# Altium schematic sheet 测试板2.SchDoc
size A3
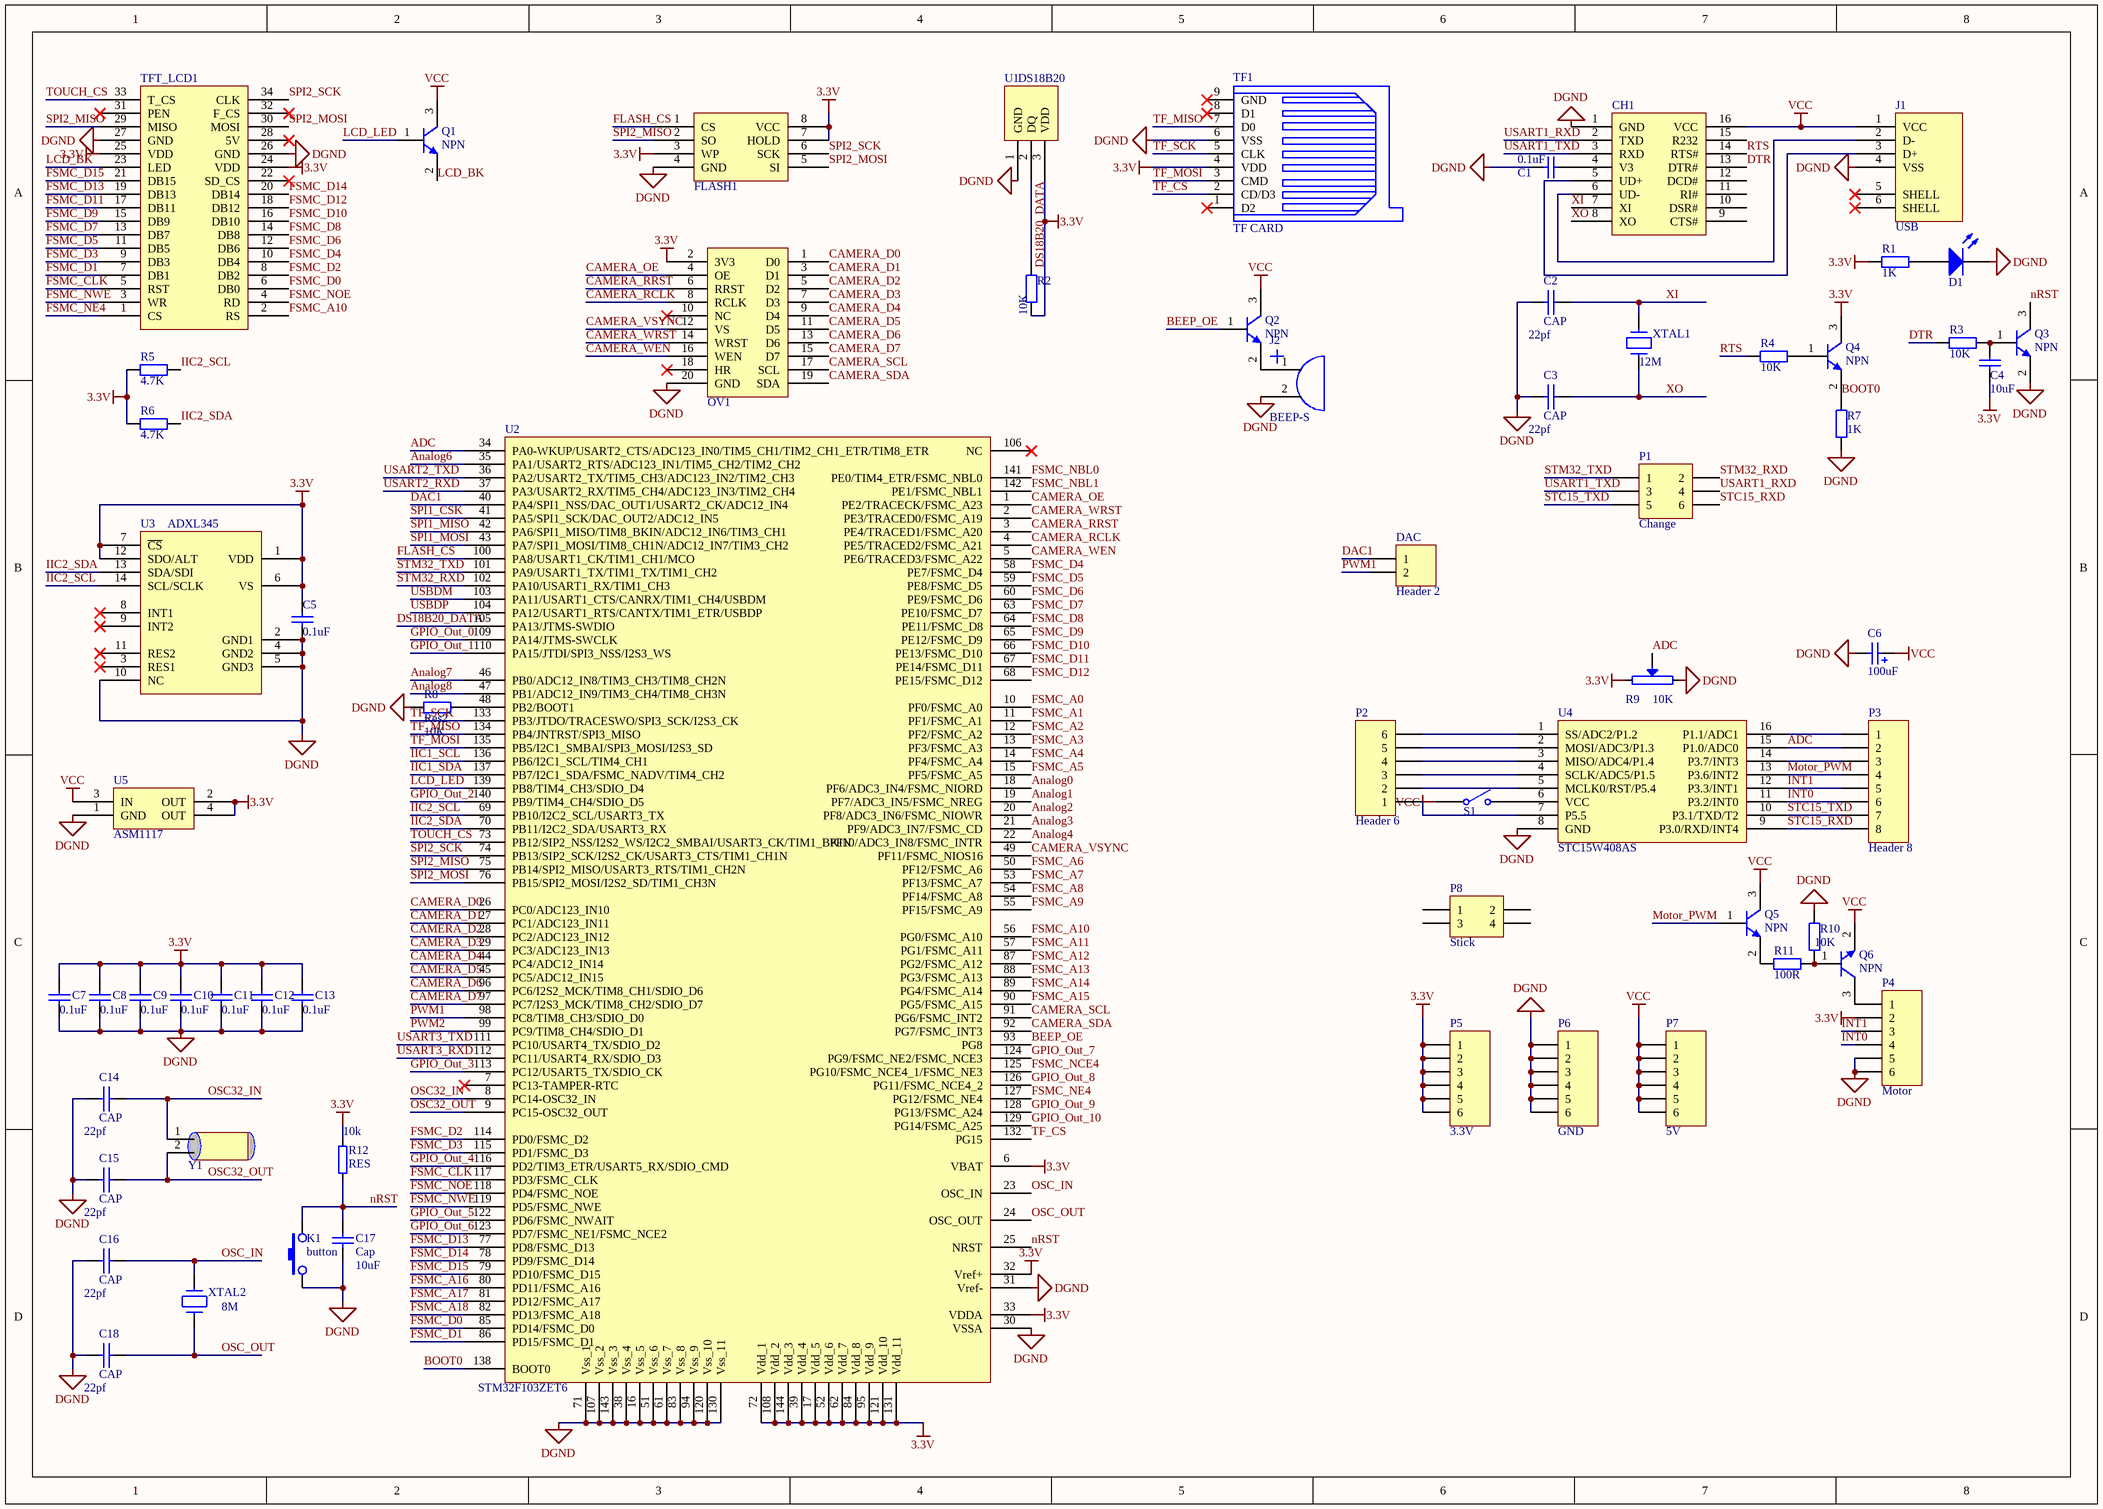
[diagram p0: 测试板2.SchDoc]

## Parts
C1  value 0.1uF  [0805]  (hidden comment: Cap)
C2  CAP  value 22pf  [0805]
C3  CAP  value 22pf  [0805]
C4  value 10uF  [1206]  (hidden comment: Cap)
C5  value 0.1uF  [0805]  (hidden comment: Cap)
C6  value 100uF  [RB.1/.3]  (hidden comment: Cap Pol2)
C7  value 0.1uF  [0805]  (hidden comment: Cap)
C8  value 0.1uF  [0805]  (hidden comment: Cap)
C9  value 0.1uF  [0805]  (hidden comment: Cap)
C10  value 0.1uF  [0805]  (hidden comment: Cap)
C11  value 0.1uF  [0805]  (hidden comment: Cap)
C12  value 0.1uF  [0805]  (hidden comment: Cap)
C13  value 0.1uF  [0805]  (hidden comment: Cap)
C14  CAP  value 22pf  [0805]
C15  CAP  value 22pf  [0805]
C16  CAP  value 22pf  [0805]
C17  Cap  value 10uF  [1206]
C18  CAP  value 22pf  [0805]
CH1  Component_1  [SOIC127P600X170-16N]  (value not drawn)
D1  LED0  [LED-0805]  (value not drawn)
DAC  Header 2  [HDR1X2]
FLASH1  W25Q64  [8S2_L]  (value not drawn)
J1  USB  [USB_B1]
J2  BEEP-S  [BEEP-S]
K1  button  [SW_PB4_A1]
OV1  OV7725摄像头  [HDR2X10]  (value not drawn)
P1  Change  [HDR2X3]
P2  Header 6  [HDR1X6]
P3  Header 8  [HDR1X8]
P4  Motor  [HDR1X6]
P5  3.3V  [HDR1X6]
P6  GND  [HDR1X6]
P7  5V  [HDR1X6]
P8  Stick  [HDR2X2]
Q1  NPN  [SOT23-3]
Q2  NPN  [SOT23-3]
Q3  NPN  [SOT23-3]
Q4  NPN  [SOT23-3]
Q5  NPN  [SOT23-3]
Q6  NPN  [SOT89N]
R1  value 1K  [0805]  (hidden comment: Res2)
R2  value 10K  [0805]  (hidden comment: Res2)
R3  value 10K  [0805]  (hidden comment: Res2)
R4  value 10K  [0805]  (hidden comment: Res2)
R5  value 4.7K  [0805]  (hidden comment: Res2)
R6  value 4.7K  [0805]  (hidden comment: Res2)
R7  value 1K  [0805]  (hidden comment: Res2)
R8  Res2  value 10K  [0805]
R9  10K  [RVR-2]
R10  value 10K  [0805]  (hidden comment: Res2)
R11  value 100R  [0805]  (hidden comment: Res2)
R12  RES  value 10k  [0805]
S1  SW-SPST  [SWITCH_B1]  (value not drawn)
TF1  TF CARD  [TFP09-2-12B]
TFT_LCD1  Component_1  [HDR2X17]  (value not drawn)
U1  DS18B20  [TO-92A]
U2  STM32F103ZET6  [TQFP-144]
U3  ADXL345  [PCBComponent_1]
U4  STC15W408AS  [SOIC127P600X170-16N]
U5  ASM1117  [SOT223]
XTAL1  value 12M  [X-SM49]  (hidden comment: CRYSTAL)
XTAL2  value 8M  [X-SM49]  (hidden comment: CRYSTAL)
Y1  32K晶振  [X-TC15]  (value not drawn)

## Nets
3.3V: C4.1 C5.2 C7.2 C8.2 C9.2 C10.2 C11.2 C12.2 C13.2 FLASH1.3(WP) FLASH1.7(HOLD) FLASH1.8(VCC) OV1.2(3V3) P4.2 P5.1 P5.2 P5.3 P5.4 P5.5 P5.6 Q4.3(C) R1.1 R2.1 R5.1 R6.1 R9.1 R12.2 TF1.4(VDD) TFT_LCD1.24(VDD) TFT_LCD1.25(VDD) U1.3(VDD) U2.6(VBAT) U2.17(Vdd_5) U2.32(Vref+) U2.33(VDDA) U2.39(Vdd_4) U2.52(Vdd_6) U2.62(Vdd_7) U2.72(Vdd_1) U2.84(Vdd_8) U2.95(Vdd_9) U2.108(Vdd_2) U2.121(Vdd_10) U2.131(Vdd_11) U2.144(Vdd_3) U3.1(VDD) U3.6(VS) U3.7(~{CS}) U3.12(SDO/ALT) U5.2(OUT) U5.4(OUT)
DGND: C1.2 C2.1 C3.1 C5.1 C6.2 C7.1 C8.1 C9.1 C10.1 C11.1 C12.1 C13.1 C14.1 C15.1 C16.1 C17.1 C18.1 CH1.1(GND) D1.2(K) FLASH1.4(GND) J1.4(VSS) J2.2 K1.1 OV1.20(GND) P4.5 P4.6 P6.1 P6.2 P6.3 P6.4 P6.5 P6.6 Q3.2(E) R7.1 R8.1 R9.2 R10.1 TF1.6(VSS) TFT_LCD1.26(GND) TFT_LCD1.27(GND) U1.1(GND) U2.16(Vss_5) U2.30(VSSA) U2.31(Vref-) U2.38(Vss_4) U2.51(Vss_6) U2.61(Vss_7) U2.71(Vss_1) U2.83(Vss_8) U2.94(Vss_9) U2.107(Vss_2) U2.120(Vss_10) U2.130(Vss_11) U2.143(Vss_3) U3.2(GND1) U3.4(GND2) U3.5(GND3) U3.10(NC) U4.8(GND) U5.1(GND)
VCC: C6.1 CH1.16(VCC) J1.1(VCC) P7.1 P7.2 P7.3 P7.4 P7.5 P7.6 Q1.3(C) Q2.3(C) Q5.3(C) Q6.2(E) S1.1(COMMON) U5.3(IN)
ADC: P3.2 R9.W U2.34(PA0-WKUP/USART2_CTS/ADC123_IN0/TIM5_CH1/TIM2_CH1_ETR/TIM8_ETR) U4.15(P1.0/ADC0)
Analog0: U2.18(PF6/ADC3_IN4/FSMC_NIORD)
Analog1: U2.19(PF7/ADC3_IN5/FSMC_NREG)
Analog2: U2.20(PF8/ADC3_IN6/FSMC_NIOWR)
Analog3: U2.21(PF9/ADC3_IN7/FSMC_CD)
Analog4: U2.22(PF10/ADC3_IN8/FSMC_INTR)
Analog6: U2.35(PA1/USART2_RTS/ADC123_IN1/TIM5_CH2/TIM2_CH2)
Analog7: U2.46(PB0/ADC12_IN8/TIM3_CH3/TIM8_CH2N)
Analog8: U2.47(PB1/ADC12_IN9/TIM3_CH4/TIM8_CH3N)
BEEP_OE: Q2.1(B) U2.93(PG8)
BOOT0: Q4.2(E) R7.2 U2.138(BOOT0)
CAMERA_D0: OV1.1(D0) U2.26(PC0/ADC123_IN10)
CAMERA_D1: OV1.3(D1) U2.27(PC1/ADC123_IN11)
CAMERA_D2: OV1.5(D2) U2.28(PC2/ADC123_IN12)
CAMERA_D3: OV1.7(D3) U2.29(PC3/ADC123_IN13)
CAMERA_D4: OV1.9(D4) U2.44(PC4/ADC12_IN14)
CAMERA_D5: OV1.11(D5) U2.45(PC5/ADC12_IN15)
CAMERA_D6: OV1.13(D6) U2.96(PC6/I2S2_MCK/TIM8_CH1/SDIO_D6)
CAMERA_D7: OV1.15(D7) U2.97(PC7/I2S3_MCK/TIM8_CH2/SDIO_D7)
CAMERA_OE: OV1.4(OE) U2.1(PE2/TRACECK/FSMC_A23)
CAMERA_RCLK: OV1.8(RCLK) U2.4(PE5/TRACED2/FSMC_A21)
CAMERA_RRST: OV1.6(RRST) U2.3(PE4/TRACED1/FSMC_A20)
CAMERA_SCL: OV1.17(SCL) U2.91(PG6/FSMC_INT2)
CAMERA_SDA: OV1.19(SDA) U2.92(PG7/FSMC_INT3)
CAMERA_VSYNC: OV1.12(VS) U2.49(PF11/FSMC_NIOS16)
CAMERA_WEN: OV1.16(WEN) U2.5(PE6/TRACED3/FSMC_A22)
CAMERA_WRST: OV1.14(WRST) U2.2(PE3/TRACED0/FSMC_A19)
DAC1: DAC.1 U2.40(PA4/SPI1_NSS/DAC_OUT1/USART2_CK/ADC12_IN4)
DS18B20_DATA: R2.2 U1.2(DQ) U2.105(PA13/JTMS-SWDIO)
DTR: CH1.13(DTR#) R3.2
FLASH_CS: FLASH1.1(CS) U2.100(PA8/USART1_CK/TIM1_CH1/MCO)
FSMC_A0: U2.10(PF0/FSMC_A0)
FSMC_A1: U2.11(PF1/FSMC_A1)
FSMC_A2: U2.12(PF2/FSMC_A2)
FSMC_A3: U2.13(PF3/FSMC_A3)
FSMC_A4: U2.14(PF4/FSMC_A4)
FSMC_A5: U2.15(PF5/FSMC_A5)
FSMC_A6: U2.50(PF12/FSMC_A6)
FSMC_A7: U2.53(PF13/FSMC_A7)
FSMC_A8: U2.54(PF14/FSMC_A8)
FSMC_A9: U2.55(PF15/FSMC_A9)
FSMC_A10: TFT_LCD1.2(RS) U2.56(PG0/FSMC_A10)
FSMC_A11: U2.57(PG1/FSMC_A11)
FSMC_A12: U2.87(PG2/FSMC_A12)
FSMC_A13: U2.88(PG3/FSMC_A13)
FSMC_A14: U2.89(PG4/FSMC_A14)
FSMC_A15: U2.90(PG5/FSMC_A15)
FSMC_A16: U2.80(PD11/FSMC_A16)
FSMC_A17: U2.81(PD12/FSMC_A17)
FSMC_A18: U2.82(PD13/FSMC_A18)
FSMC_CLK: TFT_LCD1.5(RST) U2.117(PD3/FSMC_CLK)
FSMC_D0: TFT_LCD1.6(DB0) U2.85(PD14/FSMC_D0)
FSMC_D1: TFT_LCD1.7(DB1) U2.86(PD15/FSMC_D1)
FSMC_D2: TFT_LCD1.8(DB2) U2.114(PD0/FSMC_D2)
FSMC_D3: TFT_LCD1.9(DB3) U2.115(PD1/FSMC_D3)
FSMC_D4: TFT_LCD1.10(DB4) U2.58(PE7/FSMC_D4)
FSMC_D5: TFT_LCD1.11(DB5) U2.59(PE8/FSMC_D5)
FSMC_D6: TFT_LCD1.12(DB6) U2.60(PE9/FSMC_D6)
FSMC_D7: TFT_LCD1.13(DB7) U2.63(PE10/FSMC_D7)
FSMC_D8: TFT_LCD1.14(DB8) U2.64(PE11/FSMC_D8)
FSMC_D9: TFT_LCD1.15(DB9) U2.65(PE12/FSMC_D9)
FSMC_D10: TFT_LCD1.16(DB10) U2.66(PE13/FSMC_D10)
FSMC_D11: TFT_LCD1.17(DB11) U2.67(PE14/FSMC_D11)
FSMC_D12: TFT_LCD1.18(DB12) U2.68(PE15/FSMC_D12)
FSMC_D13: TFT_LCD1.19(DB13) U2.77(PD8/FSMC_D13)
FSMC_D14: TFT_LCD1.20(DB14) U2.78(PD9/FSMC_D14)
FSMC_D15: TFT_LCD1.21(DB15) U2.79(PD10/FSMC_D15)
FSMC_NBL0: U2.141(PE0/TIM4_ETR/FSMC_NBL0)
FSMC_NBL1: U2.142(PE1/FSMC_NBL1)
FSMC_NCE4: U2.125(PG10/FSMC_NCE4_1/FSMC_NE3)
FSMC_NE4: TFT_LCD1.1(CS) U2.127(PG12/FSMC_NE4)
FSMC_NOE: TFT_LCD1.4(RD) U2.118(PD4/FSMC_NOE)
FSMC_NWE: TFT_LCD1.3(WR) U2.119(PD5/FSMC_NWE)
GPIO_Out_0: U2.109(PA14/JTMS-SWCLK)
GPIO_Out_1: U2.110(PA15/JTDI/SPI3_NSS/I2S3_WS)
GPIO_Out_2: U2.140(PB9/TIM4_CH4/SDIO_D5)
GPIO_Out_3: U2.113(PC12/USART5_TX/SDIO_CK)
GPIO_Out_4: U2.116(PD2/TIM3_ETR/USART5_RX/SDIO_CMD)
GPIO_Out_5: U2.122(PD6/FSMC_NWAIT)
GPIO_Out_6: U2.123(PD7/FSMC_NE1/FSMC_NCE2)
GPIO_Out_7: U2.124(PG9/FSMC_NE2/FSMC_NCE3)
GPIO_Out_8: U2.126(PG11/FSMC_NCE4_2)
GPIO_Out_9: U2.128(PG13/FSMC_A24)
GPIO_Out_10: U2.129(PG14/FSMC_A25)
IIC1_SCL: U2.136(PB6/I2C1_SCL/TIM4_CH1)
IIC1_SDA: U2.137(PB7/I2C1_SDA/FSMC_NADV/TIM4_CH2)
IIC2_SCL: R5.2 U2.69(PB10/I2C2_SCL/USART3_TX) U3.14(SCL/SCLK)
IIC2_SDA: R6.2 U2.70(PB11/I2C2_SDA/USART3_RX) U3.13(SDA/SDI)
INT0: P3.6 P4.4 U4.11(P3.2/INT0)
INT1: P3.5 P4.3 U4.12(P3.3/INT1)
LCD_BK: Q1.2(E) TFT_LCD1.23(LED)
LCD_LED: Q1.1(B) U2.139(PB8/TIM4_CH3/SDIO_D4)
Motor_PWM: P3.4 Q5.1(B) U4.13(P3.6/INT2)
nRST: C17.2 K1.2 Q3.3(C) R12.1 U2.25(NRST)
OSC32_IN: C14.2 U2.8(PC14-OSC32_IN) Y1.1(X1)
OSC32_OUT: C15.2 U2.9(PC15-OSC32_OUT) Y1.2(X2)
OSC_IN: C16.2 U2.23(OSC_IN) XTAL2.2
OSC_OUT: C18.2 U2.24(OSC_OUT) XTAL2.1
PWM1: DAC.2 U2.98(PC8/TIM8_CH3/SDIO_D0)
PWM2: U2.99(PC9/TIM8_CH4/SDIO_D1)
RTS: CH1.14(RTS#) R4.2
SPI1_CSK: U2.41(PA5/SPI1_SCK/DAC_OUT2/ADC12_IN5)
SPI1_MISO: U2.42(PA6/SPI1_MISO/TIM8_BKIN/ADC12_IN6/TIM3_CH1)
SPI1_MOSI: U2.43(PA7/SPI1_MOSI/TIM8_CH1N/ADC12_IN7/TIM3_CH2)
SPI2_MISO: FLASH1.2(SO) TFT_LCD1.29(MISO) U2.75(PB14/SPI2_MISO/USART3_RTS/TIM1_CH2N)
SPI2_MOSI: FLASH1.5(SI) TFT_LCD1.30(MOSI) U2.76(PB15/SPI2_MOSI/I2S2_SD/TIM1_CH3N)
SPI2_SCK: FLASH1.6(SCK) TFT_LCD1.34(CLK) U2.74(PB13/SIP2_SCK/I2S2_CK/USART3_CTS/TIM1_CH1N)
STC15_RXD: P1.6 P3.8 U4.9(P3.0/RXD/INT4)
STC15_TXD: P1.5 P3.7 U4.10(P3.1/TXD/T2)
STM32_RXD: P1.2 U2.102(PA10/USART1_RX/TIM1_CH3)
STM32_TXD: P1.1 U2.101(PA9/USART1_TX/TIM1_TX/TIM1_CH2)
TF_CS: TF1.2(CD/D3) U2.132(PG15)
TF_MISO: TF1.7(D0) U2.134(PB4/JNTRST/SPI3_MISO)
TF_MOSI: TF1.3(CMD) U2.135(PB5/I2C1_SMBAI/SPI3_MOSI/I2S3_SD)
TF_SCK: TF1.5(CLK) U2.133(PB3/JTDO/TRACESWO/SPI3_SCK/I2S3_CK)
TOUCH_CS: TFT_LCD1.33(T_CS) U2.73(PB12/SIP2_NSS/I2S2_WS/I2C2_SMBAI/USART3_CK/TIM1_BKIN)
USART1_RXD: CH1.2(TXD) P1.4
USART1_TXD: CH1.3(RXD) P1.3
USART2_RXD: U2.37(PA3/USART2_RX/TIM5_CH4/ADC123_IN3/TIM2_CH4)
USART2_TXD: U2.36(PA2/USART2_TX/TIM5_CH3/ADC123_IN2/TIM2_CH3)
USART3_RXD: U2.112(PC11/USART4_RX/SDIO_D3)
USART3_TXD: U2.111(PC10/USART4_TX/SDIO_D2)
USBDM: U2.103(PA11/USART1_CTS/CANRX/TIM1_CH4/USBDM)
USBDP: U2.104(PA12/USART1_RTS/CANTX/TIM1_ETR/USBDP)
XI: C2.2 CH1.7(XI) XTAL1.2
XO: C3.2 CH1.8(XO) XTAL1.1
NetC1_1: C1.1 CH1.4(V3)
NetC4_2: C4.2 Q3.1(B) R3.1
NetCH1_5: CH1.5(UD+) J1.3(D+)
NetCH1_6: CH1.6(UD-) J1.2(D-)
NetD1_1: D1.1(A) R1.2
NetJ2_1: J2.1 Q2.2(E)
NetP2_1: P2.1 U4.7(P5.5)
NetP2_2: P2.2 U4.5(MCLK0/RST/P5.4)
NetP2_3: P2.3 U4.4(SCLK/ADC5/P1.5)
NetP2_4: P2.4 U4.3(MISO/ADC4/P1.4)
NetP2_5: P2.5 U4.2(MOSI/ADC3/P1.3)
NetP2_6: P2.6 U4.1(SS/ADC2/P1.2)
NetP3_1: P3.1 U4.16(P1.1/ADC1)
NetP3_3: P3.3 U4.14(P3.7/INT3)
NetP4_1: P4.1 Q6.3(C)
NetQ4_1: Q4.1(B) R4.1
NetQ5_2: Q5.2(E) R11.1
NetQ6_1: Q6.1(B) R10.2 R11.2
NetR8_2: R8.2 U2.48(PB2/BOOT1)
NetS1_2: S1.2(NO) U4.6(VCC)

Not connected (* = marked no-connect by the designer): CH1 9(CTS#) 10(DSR#) 11(RI#) 12(DCD#) 15(R232); J1 5(SHELL)* 6(SHELL)*; OV1 10(NC)* 18(HR)*; P8 1 2 3 4; TF1 1(D2)* 8(D1)* 9(GND)*; TFT_LCD1 22(SD_CS)* 28(5V)* 31(PEN)* 32(F_CS)*; U2 7(PC13-TAMPER-RTC)* 106(NC)*; U3 3(RES1)* 8(INT1)* 9(INT2)* 11(RES2)*

## Library data of the parts
C1 C4 C5 C7-C13 C17 = Cap: Capacitor; Published: 8-Jun-2000; LatestRevisionDate: 17-Jul-2002; LatestRevisionNote: Re-released for DXP Platform.; PackageReference: RAD-0.3; Publisher: Altium Limited
  C1 C5 C7-C13: PackageDescription: Radial Cap, Thru-Hole; 2 Leads; 0.3 in Pin Spacing
C6 = Cap Pol2: Polarized Capacitor (Axial); Published: 8-Jun-2000; LatestRevisionDate: 17-Jul-2002; LatestRevisionNote: Re-released for DXP Platform.; PackageReference: POLAR0.8; Publisher: Altium Limited; PackageDescription: Polarized Capacitor; 2 Leads
D1 = LED0: 发光二极管; Published: 8-Jun-2000; LatestRevisionDate: 08-Jul-2005; LatestRevisionNote: Mech Layer 1 removed.; PackageReference: LED-0; Publisher: Altium Limited
DAC = Header 2: Header, 2-Pin; LatestRevisionDate: 17-Jul-2002; LatestRevisionNote: Re-released for DXP Platform.; Publisher: Altium Limited
J1 = USB: USB接口
J2 = BEEP-S: 有源蜂鸣器
P1 = Header 3X2: Header, 3-Pin, Dual row; LatestRevisionDate: 17-Jul-2002; LatestRevisionNote: Re-released for DXP Platform.; Publisher: Altium Limited
P2 P4-P7 = Header 6: Header, 6-Pin; LatestRevisionDate: 17-Jul-2002; LatestRevisionNote: Re-released for DXP Platform.; Publisher: Altium Limited
P3 = Header 8: Header, 8-Pin; LatestRevisionDate: 17-Jul-2002; LatestRevisionNote: Re-released for DXP Platform.; Publisher: Altium Limited
P8 = Header 2X2: Header, 2-Pin, Dual row; LatestRevisionDate: 17-Jul-2002; LatestRevisionNote: Re-released for DXP Platform.; Publisher: Altium Limited
Q1-Q6 = NPN1: 贴片三极管; Published: 8-Jun-2000; LatestRevisionDate: 15-Jan-2003; LatestRevisionNote: PCB Footprint 'BCY-W3/D4.7' replaced; DatasheetDocument: 1997; PackageDocument: Sep-1998; PackageReference: TO-92A; Publisher: Altium Limited; Code_JEDEC: TO-92A; ComponentLink1Description: Manufacturer Link; ComponentLink1URL: http://www.fairchildsemi.com/; ComponentLink2Description: Datasheet; ComponentLink2URL: http://www.fairchildsemi.com/ds/2N%2F2N3904.pdf
R1-R8 R10 R11 = Res2: Resistor; Published: 8-Jun-2000; LatestRevisionDate: 17-Jul-2002; LatestRevisionNote: Re-released for DXP Platform.; PackageReference: AXIAL-0.4; Publisher: Altium Limited; PackageDescription: Axial Device, Thru-Hole; 2 Leads; 0.4 in Pin Spacing
R9 = VR
S1 = SW-SPST: Single-Pole, Single-Throw Switch; Published: 24-Mar-1999; LatestRevisionDate: 17-Jul-2002; LatestRevisionNote: Re-released for DXP Platform.; PackageReference: SPST-2; Publisher: Altium Limited; PackageDescription: Switch; 2 Leads
U1 = DS18B20: 温度传感器
U5 = ASM1117: 3.3V稳压芯片